# EAGLE schematic Kaikuluotain_late (EAGLE 9.2.2)
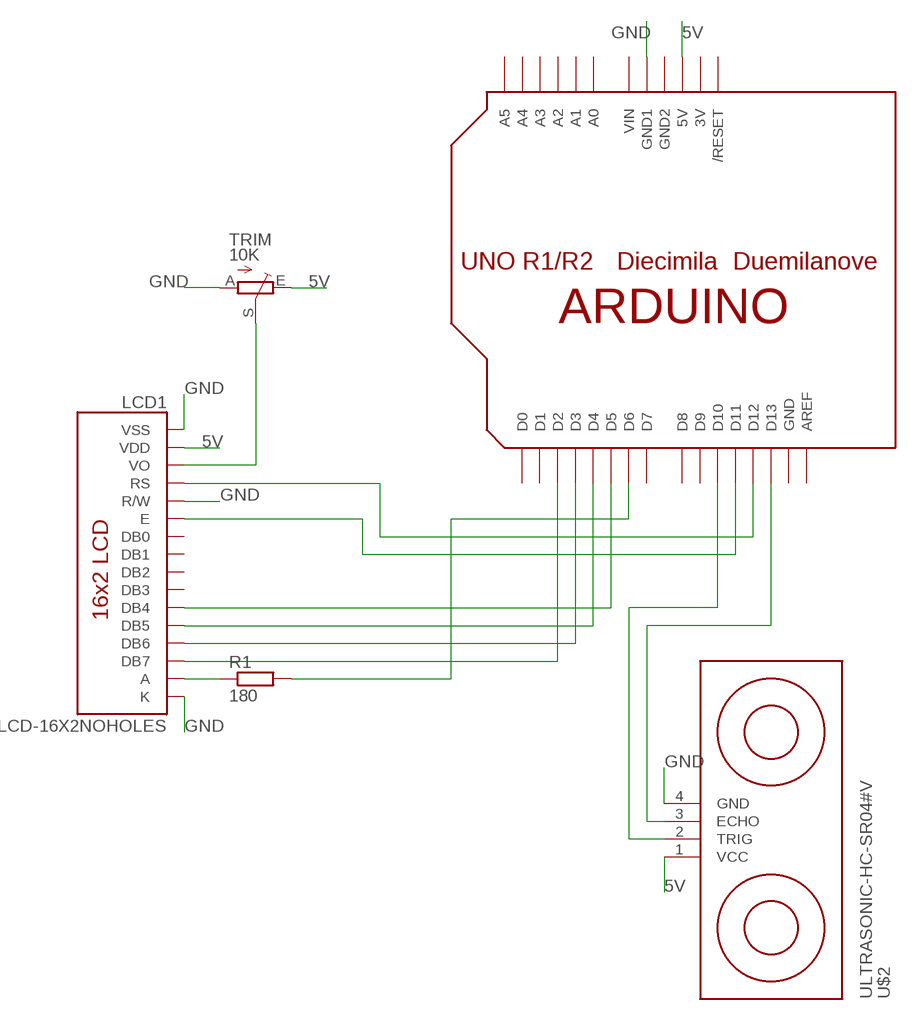
[diagram p0: schematic, sheet 1]

## Parts
LCD1  LCD-16X2NOHOLES  [LCD-16X2_NOHOLESNOSILK]
R1  180  R-EU_0411/15  [0411/15]
TRIM  10K  TRIM_EU-CA9V  [CA9V]
U$1  ARDUINO-NOHOLE  [ARDUINO-NOHOLE]
U$2  ULTRASONIC-HC-SR04#V  [ULTRASONIC-HC-SR04#V]

## Nets
5V: LCD1.2(VDD) TRIM.E U$1.5V U$2.1(VCC)
GND: LCD1.1(VSS) LCD1.5(R/W) LCD1.16(K) TRIM.A U$1.GND1 U$2.4(GND)
N$1: LCD1.15(A) R1.1
N$2: U$1.D13 U$2.3(ECHO)
N$3: U$1.D10 U$2.2(TRIG)
N$4: LCD1.3(VO) TRIM.S
N$5: LCD1.4(RS) U$1.D12
N$6: LCD1.6(E) U$1.D11
N$7: LCD1.11(DB4) U$1.D5
N$8: LCD1.12(DB5) U$1.D4
N$9: LCD1.13(DB6) U$1.D3
N$10: LCD1.14(DB7) U$1.D2
N$11: R1.2 U$1.D6
Unconnected: LCD1.7(DB0) LCD1.8(DB1) LCD1.9(DB2) LCD1.10(DB3) U$1.A0 U$1.A1 U$1.A2 U$1.A3 U$1.A4 U$1.A5 U$1.AREF U$1.D0 U$1.D1 U$1.D7 U$1.D8 U$1.D9 U$1.RESET(/RESET)

## Power pins joined to a net without a drawn wire
3V: U$1.3V
GND: U$1.GND
GND2: U$1.GND2
VIN: U$1.VIN

## Library data of the parts
LCD1 = SparkFun-Displays:LCD-16X2: Standard text-only 16x2 parallel input LCD Basic 16 character by 2 line display. Typically utilizes the extremely common HD44780 parallel interface chipset SparkFun Products: Basic 16x2 Green <https://www.sparkfun.com/products/255> Basic 8x2 Green <https://www.sparkfun.com/products/11122>; SF_ID: LCD-00255
R1 = resistor:R-EU_: RESISTOR, European symbol
TRIM = pot:TRIM_EU-: POTENTIOMETER
U$1 = adafruit:ARDUINO: Arduino Diecimila/Duemilanove Make a shield with ease, this package has all the named pins as well as the two mounting drill holes and an outline of the USB and DC power connector. The outline is on the DIMENSION layer, so if your board house uses it they will cut the outline to match. http://www.ladyada.net/library/pcb/eaglelibrary.html
U$2 = diy-modules:ULTRASONIC-HC-SR04: Ultrasonic Ranging Module HC-SR04 More details available here: http://randomnerdtutorials.com/complete-guide-for-ultrasonic-sensor-hc-sr04/ Click here to find device on ebay.com <http://www.ebay.com/sch/hc+sr04+ultrasonic>